# Altium schematic sheet POWER_SUPPLIES.SchDoc
size A4
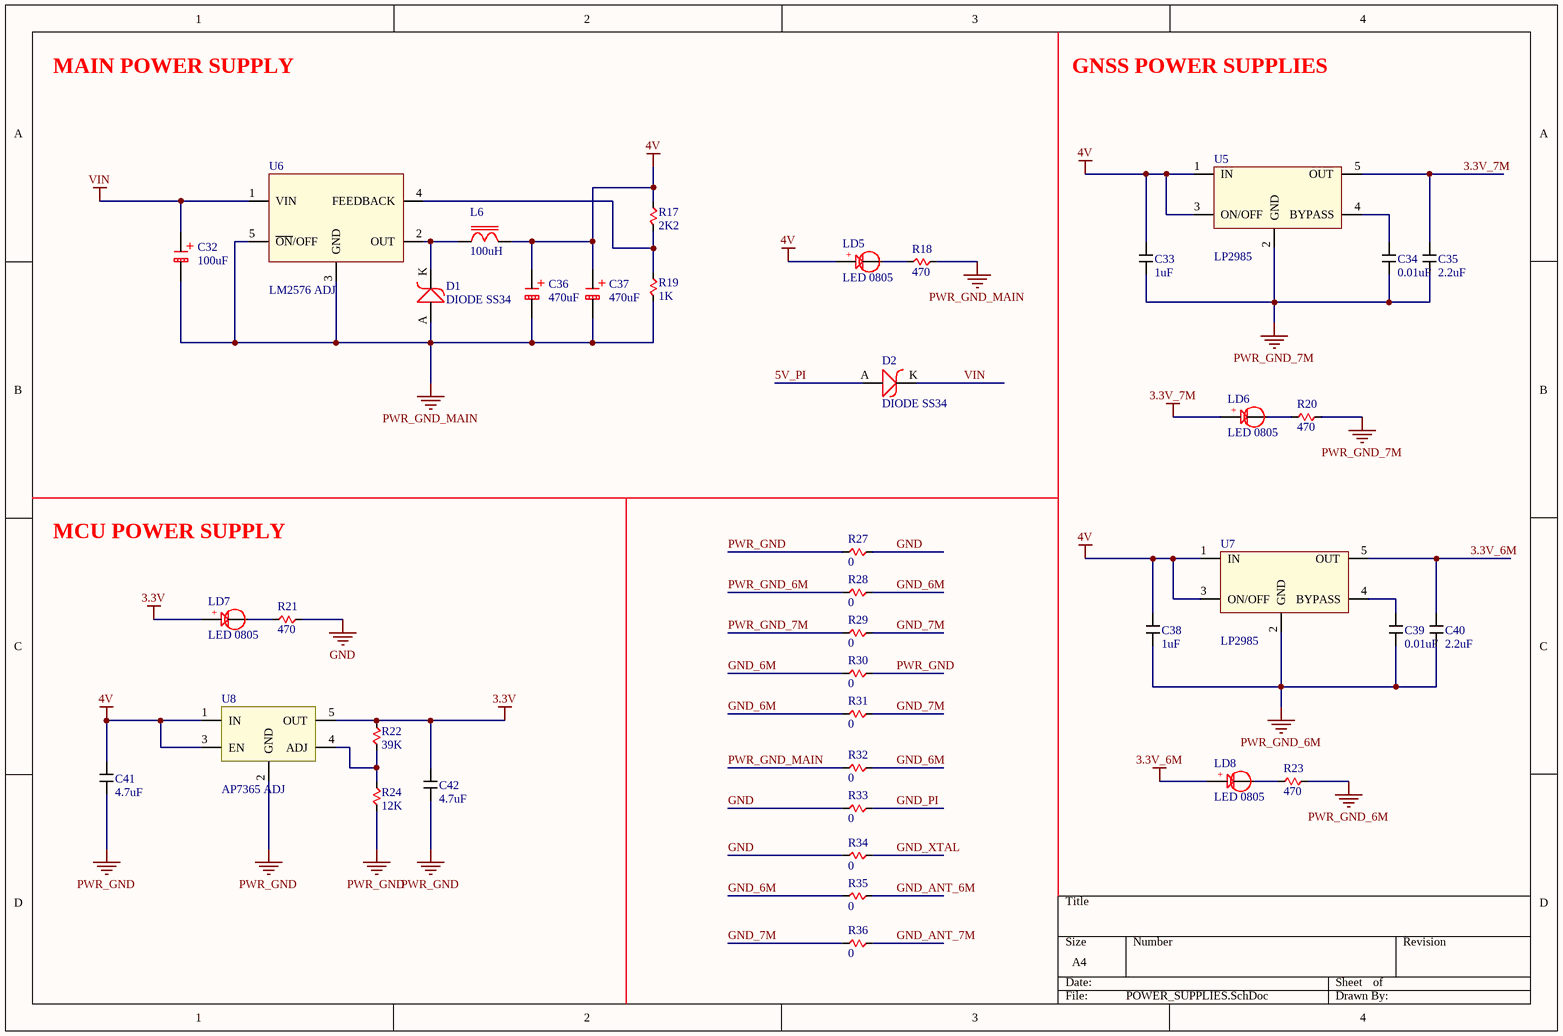
[diagram p0: POWER_SUPPLIES.SchDoc]

## Parts
C32  100uF  [C TATAL 3528]
C33  1uF  [C 0805]
C34  0.01uF  [C 0805]
C35  2.2uF  [C 0805]
C36  470uF  [C TATAL 7343]
C37  470uF  [C TATAL 7343]
C38  1uF  [C 0805]
C39  0.01uF  [C 0805]
C40  2.2uF  [C 0805]
C41  4.7uF  [C 0805]
C42  4.7uF  [C 0805]
D1  DIODE SS34  [DIODE SS34]
D2  DIODE SS34  [DIODE SS34]
L6  100uH  [L 4600]
LD5  LED 0805  [LED 0805]
LD6  LED 0805  [LED 0805]
LD7  LED 0805  [LED 0805]
LD8  LED 0805  [LED 0805]
R17  2K2  [R 0805]
R18  470  [R 0805]
R19  1K  [R 0805]
R20  470  [R 0805]
R21  470  [R 0805]
R22  39K  [R 0805]
R23  470  [R 0805]
R24  12K  [R 0805]
R27  0  [R 0805]
R28  0  [R 0805]
R29  0  [R 0805]
R30  0  [R 0805]
R31  0  [R 0805]
R32  0  [R 0805]
R33  0  [R 0805]
R34  0  [R 0805]
R35  0  [R 0805]
R36  0  [R 0805]
U5  LP2985  [LP2985]
U6  LM2576 ADJ  [LM2576 ADJ]
U7  LP2985  [LP2985]
U8  AP7365 ADJ  [AP7365 ADJ]

## Nets
3.3V: C42.1 LD7.1 R22.1 U8.5(OUT)
3.3V_6M: C40.2 LD8.1 U7.5(OUT)
3.3V_7M: C35.2 LD6.1 U5.5(OUT)
4V: C33.2 C36.1 C37.1 C38.2 C41.1 L6.2 LD5.1 R17.2 U5.1(IN) U5.3(ON/OFF) U7.1(IN) U7.3(ON/OFF) U8.1(IN) U8.3(EN)
GND: R21.1 R27.2 R33.1 R34.1
PWR_GND: C41.2 C42.2 R24.2 R27.1 R30.2 U8.2(GND)
PWR_GND_6M: C38.1 C39.1 C40.1 R23.1 R28.1 U7.2(GND)
PWR_GND_7M: C33.1 C34.1 C35.1 R20.1 R29.1 U5.2(GND)
PWR_GND_MAIN: C32.2 C36.2 C37.2 D1.A R18.1 R19.1 R32.1 U6.3(GND) U6.5(~{ON}/OFF)
VIN: C32.1 D2.K U6.1(VIN)
5V_PI: D2.A
GND_6M: R28.2 R30.1 R31.1 R32.2 R35.1
GND_7M: R29.2 R31.2 R36.1
GND_ANT_6M: R35.2
GND_ANT_7M: R36.2
GND_PI: R33.2
GND_XTAL: R34.2
NetC34_2: C34.2 U5.4(BYPASS)
NetC39_2: C39.2 U7.4(BYPASS)
NetD1_K: D1.K L6.1 U6.2(OUT)
NetLD5_2: LD5.2 R18.2
NetLD6_2: LD6.2 R20.2
NetLD7_2: LD7.2 R21.2
NetLD8_2: LD8.2 R23.2
NetR17_1: R17.1 R19.2 U6.4(FEEDBACK)
NetR22_2: R22.2 R24.1 U8.4(ADJ)

## Notes on the sheet
- MAIN POWER SUPPLY
- GNSS POWER SUPPLIES
- MCU POWER SUPPLY
- (in symbol C TATAL 3528) +
- (in symbol C TATAL 7343) +
- (in symbol LED 0805) +

## Library data of the parts
C32 = C TATAL 3528
C33-C35 C38-C42 = C 0805
C36 C37 = C TATAL 7343
L6 = L 4600
R17-R24 R27-R36 = R 0805
U5 U7 = LP2985 LDO